# EAGLE design HHKBLite2BTforArduinoProMicro33 (EAGLE 7.1.0)
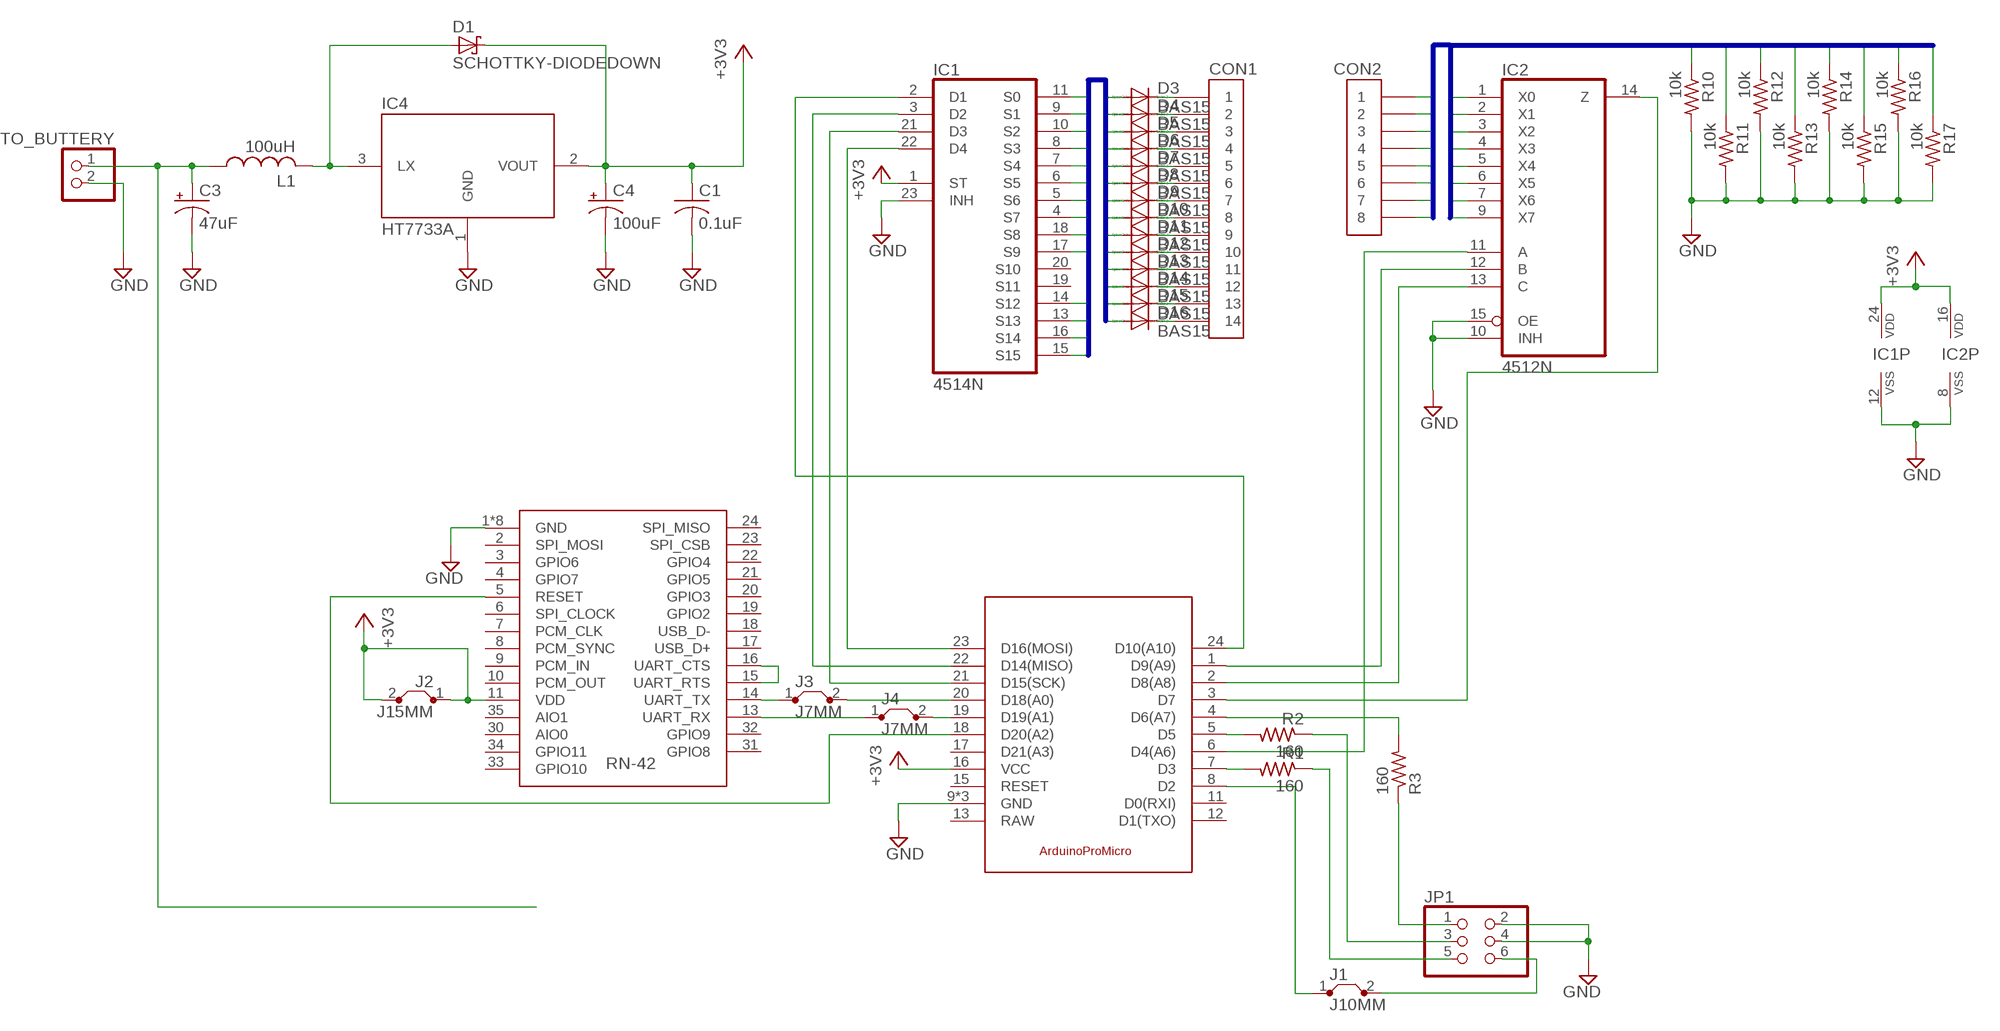
[diagram p0: schematic, sheet 1]

## Parts
C1  0.1uF  C-US050-024X044  [C050-024X044]
C3  47uF  CPOL-USE2.5-7  [E2,5-7]
C4  100uF  CPOL-USE2.5-7  [E2,5-7]
CON1  45045-1445  [52045-1445]
CON2  45045-0845  [52045-0845]
D1  SCHOTTKY-DIODEDOWN  [DIODE-STAND-DOWN]
D3  BAS15  [DO34-7]
D4  BAS15  [DO34-7]
D5  BAS15  [DO34-7]
D6  BAS15  [DO34-7]
D7  BAS15  [DO34-7]
D8  BAS15  [DO34-7]
D9  BAS15  [DO34-7]
D10  BAS15  [DO34-7]
D11  BAS15  [DO34-7]
D12  BAS15  [DO34-7]
D13  BAS15  [DO34-7]
D14  BAS15  [DO34-7]
D15  BAS15  [DO34-7]
D16  BAS15  [DO34-7]
IC1  4514N  [DIL24-6]
IC2  4512N  [DIL16]
IC4  HT7733A  [TO-92]
J1  J10MM  [10]
J2  J15MM  [15]
J3  J7MM  [07]
J4  J7MM  [07]
JP1  PINHD-2X3/90  [2X03/90]
L1  100uH  LL5-10  [E5-10]
R1  160  R-US_0207/7  [0207/7]
R2  160  R-US_0207/7  [0207/7]
R3  160  R-US_0207/10  [0207/10]
R10  10k  R-US_0207/7  [0207/7]
R11  10k  R-US_0207/7  [0207/7]
R12  10k  R-US_0207/7  [0207/7]
R13  10k  R-US_0207/10  [0207/10]
R14  10k  R-US_0207/7  [0207/7]
R15  10k  R-US_0207/7  [0207/7]
R16  10k  R-US_0207/7  [0207/7]
R17  10k  R-US_0207/7  [0207/7]
TO_BUTTERY  PINHD-1X2  [1X02]
U$1  RN-42  [RN-42]
U$2  ARDUINO_PRO_MICRO  [ARDUINO_PRO_MICRO]

## Nets
+3V3 [Vcc]: C1.1 C4.+ D1.C IC1.1(ST) IC1.24(VDD) IC2.16(VDD) IC4.2(VOUT) J2.1 J2.2 U$1.11(VDD) U$2.16(VCC)
CON1BUS_O0: D3.A IC1.11(S0)
CON1BUS_O1: D5.A IC1.9(S1)
CON1BUS_O2: D4.A IC1.10(S2)
CON1BUS_O3: D6.A IC1.8(S3)
CON1BUS_O4: D7.A IC1.7(S4)
CON1BUS_O5: D8.A IC1.6(S5)
CON1BUS_O6: D9.A IC1.5(S6)
CON1BUS_O7: D10.A IC1.4(S7)
CON1BUS_O8: D11.A IC1.18(S8)
CON1BUS_O9: D16.A IC1.17(S9)
CON1BUS_O12: D13.A IC1.14(S12)
CON1BUS_O13: D12.A IC1.13(S13)
CON1BUS_O14: D15.A IC1.16(S14)
CON1BUS_O15: D14.A IC1.15(S15)
CON2BUS_D0: CON2.8 IC2.1(X0) R10.1
CON2BUS_D1: CON2.7 IC2.2(X1) R11.1
CON2BUS_D2: CON2.6 IC2.3(X2) R12.1
CON2BUS_D3: CON2.5 IC2.4(X3) R13.1
CON2BUS_D4: CON2.4 IC2.5(X4) R14.1
CON2BUS_D5: CON2.3 IC2.6(X5) R15.1
CON2BUS_D6: CON2.2 IC2.7(X6) R16.1
CON2BUS_D7: CON2.1 IC2.9(X7) R17.1
GND [GND]: C1.2 C3.- C4.- IC1.12(VSS) IC1.23(INH) IC2.8(VSS) IC2.10(INH) IC2.15(OE) IC4.1(GND) JP1.2 JP1.4 R10.2 R11.2 R12.2 R13.2 R14.2 R15.2 R16.2 R17.2 TO_BUTTERY.2 U$1.1(GND) U$1.12(GND) U$1.28(GND) U$1.29(GND) U$1.GND1(GND) U$1.GND2(GND) U$1.GND3(GND) U$1.GND4(GND) U$2.9(GND) U$2.10(GND) U$2.14(GND)
N$1: R3.2 U$2.4(D6(A7))
N$2: R1.2 U$2.7(D3)
N$3 [VccSrc]: D1.A IC4.3(LX) L1.+1
N$4: R2.2 U$2.5(D5)
N$5: J3.1 U$1.14(UART_TX)
N$6: U$1.5(RESET) U$2.18(D20(A2))
N$7: J3.2 U$2.20(D18(A0))
N$8: JP1.1 R3.1
N$9: IC2.14(Z) U$2.3(D7)
N$10: JP1.3 R2.1
N$11: JP1.5 R1.1
N$12: J1.2 JP1.6
N$13: J1.1 U$2.8(D2)
N$14: J4.1 U$1.13(UART_RX)
N$16: IC2.12(B) U$2.1(D9(A9))
N$17: IC2.13(C) U$2.2(D8(A8))
N$18: J4.2 U$2.19(D19(A1))
N$20: U$1.15(UART_RTS) U$1.16(UART_CTS)
N$22: IC2.11(A) U$2.6(D4(A6))
N$36: IC1.2(D1) U$2.24(D10(A10))
N$37: IC1.3(D2) U$2.22(D14(MISO))
N$38: IC1.21(D3) U$2.21(D15(SCK))
N$39: IC1.22(D4) U$2.23(D16(MOSI))
N$49: CON1.1 D3.C
N$50: CON1.2 D4.C
N$51: CON1.3 D5.C
N$52: CON1.4 D6.C
N$53: CON1.5 D7.C
N$54: CON1.6 D8.C
N$55: CON1.7 D9.C
N$56: CON1.8 D10.C
N$57: CON1.9 D11.C
N$58: CON1.10 D12.C
N$59: CON1.11 D13.C
N$60: CON1.12 D14.C
N$61: CON1.13 D15.C
N$62: CON1.14 D16.C
VCC_SRC [VccSrc]: C3.+ L1.+ TO_BUTTERY.1
Unconnected: IC1.19(S11) IC1.20(S10) U$1.2(SPI_MOSI) U$1.3(GPIO6) U$1.4(GPIO7) U$1.6(SPI_CLOCK) U$1.7(PCM_CLK) U$1.8(PCM_SYNC) U$1.9(PCM_IN) U$1.10(PCM_OUT) U$1.17(USB_D+) U$1.18(USB_D-) U$1.19(GPIO2) U$1.20(GPIO3) U$1.21(GPIO5) U$1.22(GPIO4) U$1.23(SPI_CSB) U$1.24(SPI_MISO) U$1.30(AIO0) U$1.31(GPIO8) U$1.32(GPIO9) U$1.33(GPIO10) U$1.34(GPIO11) U$1.35(AIO1) U$2.11(D0(RXI)) U$2.12(D1(TXO)) U$2.13(RAW) U$2.15(RESET) U$2.17(D21(A3))

## Buses
CON2BUS_D[0..7]
CON1BUS_O[0..15]

## Library data of the parts
C1 = rcl:C-US: CAPACITOR, American symbol
C3 C4 = rcl:CPOL-US: POLARIZED CAPACITOR, American symbol
CON1 = 5204:45045-1445
CON2 = 5204:45045-0845
D1 = MySilicon:SCHOTTKY-DIODE
D3-D16 = diode:BAS15: DIODE high speed
IC1 = 45xx:4514: 4-bit latch 4-16 line DECODER
IC2 = 45xx:4512: 8-channel DATA SELECTOR Inhibit function corrected - 2005.10.04 librarian@cadsoft.de
IC4 = HT77XXA:HT7733A
J1-J4 = jumper:J: Bridge
JP1 = pinhead:PINHD-2X3: PIN HEADER
L1 = MyRCL:L
R1-R3 R10-R12 R14-R17 = rcl:R-US_: RESISTOR, American symbol
R13 = resistor:R-US_: RESISTOR, American symbol
TO_BUTTERY = pinhead:PINHD-1X2: PIN HEADER
U$1 = RN-42:RN-42
U$2 = ArduinoProMicro:ARDUINO_PRO_MICRO

## Net classes
0 default: clearance 0.254 mm
1 Vcc: width 0.025 mm, clearance 0.205 mm
2 VccSrc: clearance 0.508 mm
3 GND: clearance 0.508 mm to class 1, clearance 0.508 mm to class 2, clearance 0.205 mm

## Board
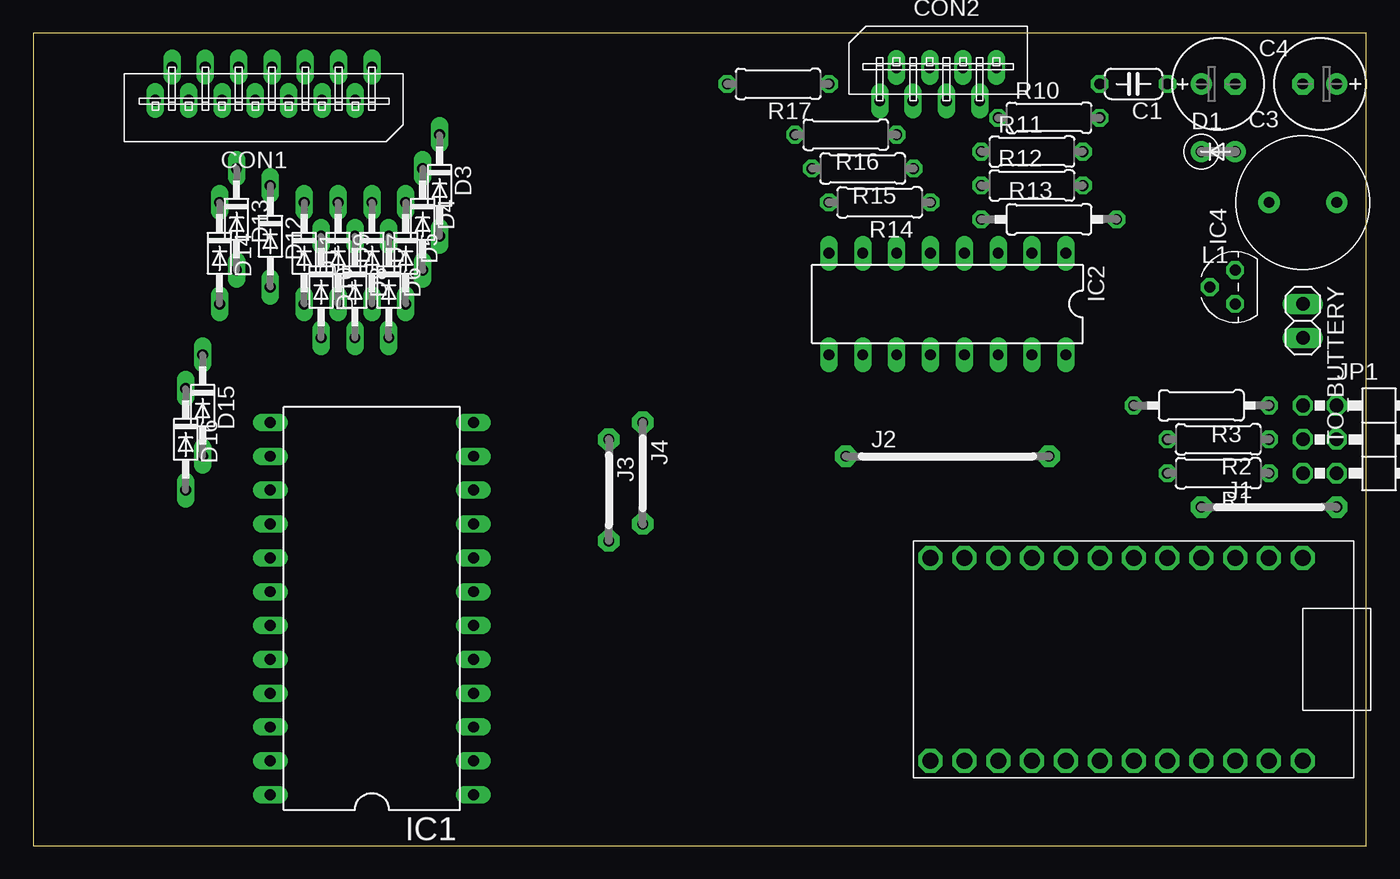
[diagram p1: board, top side]
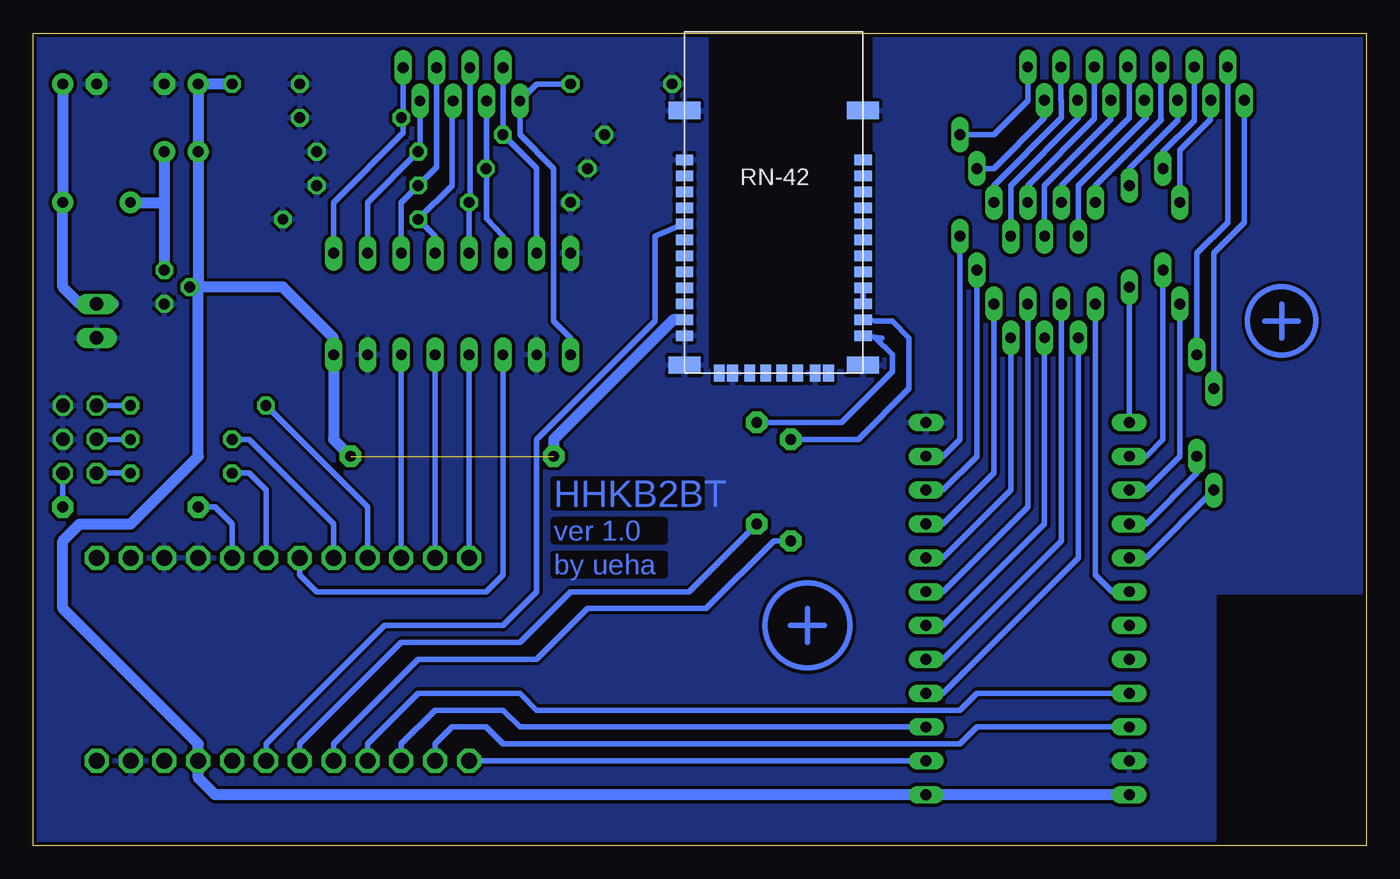
[diagram p2: board, bottom side, seen from below]

Size 100 x 60.95 mm. Coordinates in mm from the lower left corner, seen from the top.
Outline: 0,0 100,0 100,60.95 0,60.95 0,0
Copper layers (1*16): Top 0.035mm / dielectric 1.5mm / Bottom 0.035mm
Design rules "HHKBLite2BTforArduinoProMicro33 *": minimum track width 10mil, minimum drill 24mil, track to track 0.205mm, track to pad 0.205mm, pad to pad 0.205mm, via to via 0.205mm, smd to smd 8mil, copper to edge 0.2mm, drill to drill 8mil, minimum pad ring 10mil, minimum via ring 8mil, stop-mask expansion 4mil, vias tented up to drill 0mil, thermal gap 10mil

### Footprints (pad centres in the part's own frame; a part is rotated, then mirrored left to right if it is on the bottom)
C050-024X044 = drill 0.813 octagon: 1 -2.54,0; 2 2.54,0
E2,5-7 = drill 0.813 pad 1.6: + -1.27,0 | drill 0.813 pad 1.6 octagon: - 1.27,0
52045-1445 = drill 0.813 long: 1 0,0; 2 1.25,2.5; 3 2.5,0; 4 3.75,2.5; 5 5,0; 6 6.25,2.5; 7 7.5,0; 8 8.75,2.5; 9 10,0; 10 11.25,2.5; 11 12.5,0; 12 13.75,2.5; 13 15,0; 14 16.25,2.5
52045-0845 = drill 0.813 long: 1 0,0; 2 1.25,2.5; 3 2.5,0; 4 3.75,2.5; 5 5,0; 6 6.25,2.5; 7 7.5,0; 8 8.75,2.5
DIODE-STAND-DOWN = drill 0.813 pad 1.6: A 1.27,0; C -1.27,0
DO34-7 = drill 0.813 long: A 3.81,0; C -3.81,0
DIL24-6 = drill 0.813 long: 1 -13.97,-7.62; 2 -11.43,-7.62; 3 -8.89,-7.62; 4 -6.35,-7.62; 5 -3.81,-7.62; 6 -1.27,-7.62; 7 1.27,-7.62; 8 3.81,-7.62; 9 6.35,-7.62; 10 8.89,-7.62; 11 11.43,-7.62; 12 13.97,-7.62; 13 13.97,7.62; 14 11.43,7.62; 15 8.89,7.62; 16 6.35,7.62; 17 3.81,7.62; 18 1.27,7.62; 19 -1.27,7.62; 20 -3.81,7.62; 21 -6.35,7.62; 22 -8.89,7.62; 23 -11.43,7.62; 24 -13.97,7.62
DIL16 = drill 0.813 long: 1 -8.89,-3.81; 2 -6.35,-3.81; 3 -3.81,-3.81; 4 -1.27,-3.81; 5 1.27,-3.81; 6 3.81,-3.81; 7 6.35,-3.81; 8 8.89,-3.81; 9 8.89,3.81; 10 6.35,3.81; 11 3.81,3.81; 12 1.27,3.81; 13 -1.27,3.81; 14 -3.81,3.81; 15 -6.35,3.81; 16 -8.89,3.81
TO-92 = drill 0.813 octagon: 1 -1.27,0; 2 0,1.905; 3 1.27,0
10 = drill 0.813 pad 1.6 octagon: 1 -5.08,0; 2 5.08,0
15 = drill 0.813 pad 1.6 octagon: 1 -7.62,0; 2 7.62,0
07 = drill 0.813 pad 1.6 octagon: 1 -3.81,0; 2 3.81,0
2X03/90 = drill 1.016 octagon: 1 -2.54,-6.35; 2 -2.54,-3.81; 3 0,-6.35; 4 0,-3.81; 5 2.54,-6.35; 6 2.54,-3.81
E5-10 = drill 0.813 pad 1.6: + -2.54,0; +1 2.54,0
0207/7 = drill 0.813 octagon: 1 -3.81,0; 2 3.81,0
0207/10 = drill 0.813 octagon: 1 -5.08,0; 2 5.08,0
1X02 = drill 1.016 long: 1 -1.27,0; 2 1.27,0
RN-42 = smd 1.3 x 0.8: 1 -6.7,3.2; 2 -6.7,2; 3 -6.7,0.8; 4 -6.7,-0.4; 5 -6.7,-1.6; 6 -6.7,-2.8; 7 -6.7,-4; 8 -6.7,-5.2; 9 -6.7,-6.4; 10 -6.7,-7.6; 11 -6.7,-8.8; 12 -6.7,-10; 13 6.7,-10; 14 6.7,-8.8; 15 6.7,-7.6; 16 6.7,-6.4; 17 6.7,-5.2; 18 6.7,-4; 19 6.7,-2.8; 20 6.7,-1.6; 21 6.7,-0.4; 22 6.7,0.8; 23 6.7,2; 24 6.7,3.2 | smd 0.8 x 1.3: 28 3.1,-12.8; 29 -3.1,-12.8; 30 4.1,-12.8; 31 1.8,-12.8; 32 0.6,-12.8; 33 -0.6,-12.8; 34 -1.8,-12.8; 35 -4.1,-12.8 | smd 2.4 x 1.3: GND1 -6.7,6.9; GND2 6.7,6.9; GND3 -6.7,-12.2; GND4 6.7,-12.2
ARDUINO_PRO_MICRO = drill 1.2 octagon: 1 -7.62,-15.24; 2 -7.62,-12.7; 3 -7.62,-10.16; 4 -7.62,-7.62; 5 -7.62,-5.08; 6 -7.62,-2.54; 7 -7.62,0; 8 -7.62,2.54; 9 -7.62,5.08; 10 -7.62,7.62; 11 -7.62,10.16; 12 -7.62,12.7; 13 7.62,12.7; 14 7.62,10.16; 15 7.62,7.62; 16 7.62,5.08; 17 7.62,2.54; 18 7.62,0; 19 7.62,-2.54; 20 7.62,-5.08; 21 7.62,-7.62; 22 7.62,-10.16; 23 7.62,-12.7; 24 7.62,-15.24

### Placement (x,y rotation side)
C1  82.55,57.15 180 top
C3  96.52,57.15 180 top
C4  88.9,57.15 0 top
CON1  25.4,58.42 180 top
CON2  63.5,55.88 0 top
D1  88.9,52.07 0 top
D3  30.48,49.53 270 top
D4  29.21,46.99 270 top
D5  27.94,44.45 270 top
D6  26.67,41.91 270 top
D7  25.4,44.45 270 top
D8  24.13,41.91 270 top
D9  22.86,44.45 270 top
D10  21.59,41.91 270 top
D11  20.32,44.45 270 top
D12  17.78,45.72 270 top
D13  15.24,46.99 270 top
D14  13.97,44.45 270 top
D15  12.7,33.02 270 top
D16  11.43,30.48 270 top
IC1  25.4,17.78 90 top
IC2  68.58,40.64 180 top
IC4  90.17,41.91 90 top
J1  92.71,25.4 0 top
J2  68.58,29.21 0 top
J3  43.18,26.67 270 top
J4  45.72,27.94 270 top
JP1  101.6,30.48 270 top
L1  95.25,48.26 180 top
R1  88.9,27.94 180 top
R2  88.9,30.48 180 top
R3  87.63,33.02 180 top
R10  76.2,54.61 0 top
R11  74.93,52.07 0 top
R12  74.93,49.53 0 top
R13  76.2,46.99 0 top
R14  63.5,48.26 180 top
R15  62.23,50.8 180 top
R16  60.96,53.34 180 top
R17  55.88,57.15 180 top
TO_BUTTERY  95.25,39.37 270 top
U$1  44.45,48.26 0 bottom
U$2  82.55,13.97 270 top

### Tracks (layer width: path | path; a pad name or v marks a point on that pad's centre or on a via)
+3V3  (1 unrouted)
  Bottom 0.813: IC1.24 IC1.1 86.36,3.81 87.63,5.08 U$2.16 87.63,7.62 97.79,17.78 97.79,22.86 96.52,24.13 92.71,24.13 87.63,29.21 87.63,41.91 | U$1.11 51.98,39.46 60.96,30.48 J2.1 | 87.63,41.91 IC4.2 | 87.63,41.91 81.28,41.91 77.47,38.1 IC2.16 77.47,30.48 J2.2 | C1.1 C4.+ D1.C 87.63,41.91
CON1BUS_O0
  Bottom 0.406: D3.A 30.48,30.48 31.75,29.21 IC1.11
CON1BUS_O1
  Bottom 0.406: D5.A 27.94,27.94 31.75,24.13 IC1.9
CON1BUS_O2
  Bottom 0.406: D4.A 29.21,29.21 31.75,26.67 IC1.10
CON1BUS_O3
  Bottom 0.406: D6.A 26.67,26.67 31.75,21.59 IC1.8
CON1BUS_O4
  Bottom 0.406: D7.A 25.4,25.4 31.75,19.05 IC1.7
CON1BUS_O5
  Bottom 0.406: D8.A 24.13,24.13 31.75,16.51 IC1.6
CON1BUS_O6
  Bottom 0.406: D9.A 22.86,22.86 31.75,13.97 IC1.5
CON1BUS_O7
  Bottom 0.406: D10.A 21.59,21.59 31.75,11.43 IC1.4
CON1BUS_O8
  Bottom 0.406: D11.A 20.32,20.32 19.05,19.05 IC1.18
CON1BUS_O9
  Bottom 0.406: IC1.17 16.51,21.59 D16.A
CON1BUS_O12
  Bottom 0.406: D13.A 15.24,30.48 16.51,29.21 IC1.14
CON1BUS_O13
  Bottom 0.406: D12.A IC1.13
CON1BUS_O14
  Bottom 0.406: IC1.16 16.51,24.13 12.7,27.94 D15.A
CON1BUS_O15
  Bottom 0.406: D14.A 13.97,29.21 16.51,26.67 IC1.15
CON2BUS_D0
  Bottom 0.406: CON2.8 72.25,54.61 | 72.25,54.61 72.25,53.48 77.47,48.26 IC2.1 | R10.1 72.25,54.61
CON2BUS_D1
  Bottom 0.406: CON2.7 71,52.19 R11.1 74.93,48.26 IC2.2
CON2BUS_D2
  Bottom 0.406: CON2.6 69.75,50.9 R12.1 72.39,48.26 IC2.3
CON2BUS_D3
  Bottom 0.406: IC2.4 69.85,45.72 R13.1 68.58,49.53 68.58,55.8 CON2.5
CON2BUS_D4
  Bottom 0.406: CON2.4 67.25,48.32 R14.1 IC2.5
CON2BUS_D5
  Bottom 0.406: CON2.3 66,50.8 | 66,50.8 66,47.03 64.77,45.72 IC2.6 | R15.1 66,50.8
CON2BUS_D6
  Bottom 0.406: CON2.2 64.75,53.34 | 62.21,45.74 IC2.7 62.23,50.82 64.75,53.34 | R16.1 64.75,53.34
CON2BUS_D7
  Bottom 0.406: R17.1 62.23,57.15 CON2.1 63.5,53.34 60.96,50.8 60.96,39.37 59.69,38.1 IC2.9
GND
  pour Bottom (isolate 0.254): 0,19.05 11.43,19.05 11.43,0 100.33,0 100.33,60.96 49.53,60.96 49.53,35.56 36.83,35.56 36.83,60.96 0,60.96
N$1
  Bottom 0.406: 74.93,22.86 U$2.4 74.93,25.4 R3.2
N$2
  Bottom 0.406: U$2.7 82.55,26.67 83.82,27.94 R1.2
N$3
  Bottom 0.813: D1.A 90.17,48.26 | 90.17,48.26 IC4.3 | L1.+1 90.17,48.26
N$4
  Bottom 0.406: U$2.5 77.47,24.13 83.82,30.48 R2.2
N$5
  Bottom 0.406: U$1.14 36.57,39.37 | 36.57,39.37 36.83,39.37 | 36.57,39.37 35.56,39.37 34.29,38.1 34.29,34.29 38.1,30.48 J3.1
N$6
  Bottom 0.406: U$1.5 51.13,46.66 53.34,45.72 53.34,39.37 62.23,30.48 62.23,19.05 64.77,16.51 73.66,16.51 82.55,7.62 U$2.18
N$7
  Bottom 0.406: U$2.20 77.47,7.62 71.12,13.97 62.23,13.97 58.42,17.78 49.53,17.78 44.45,22.86 J3.2
N$8
  Bottom 0.406: R3.1 JP1.1
N$9
  Bottom 0.406: IC2.14 U$2.3
N$10
  Bottom 0.406: R2.1 JP1.3
N$11
  Bottom 0.406: R1.1 JP1.5
N$12
  Bottom 0.406: J1.2 JP1.6
N$13
  Bottom 0.406: J1.1 86.36,25.4 85.09,24.13 U$2.8
N$14
  Bottom 0.406: U$1.13 36.32,38.1 36.83,38.1 35.56,36.83 35.56,35.56 39.37,31.75 J4.1
N$15
  Bottom 0.406: 5.08,39.37 6.35,39.37 | 7.62,39.37 6.35,39.37 | 6.35,39.37 6.35,40.64 | 6.35,39.37 6.35,38.1
N$16
  Bottom 0.406: IC2.12 U$2.1
N$17
  Bottom 0.406: IC2.13 U$2.2
N$18
  Bottom 0.406: U$2.19 80.01,7.62 72.39,15.24 63.5,15.24 59.69,19.05 50.8,19.05 J4.2
N$20
  Bottom 0.406: U$1.16 U$1.15
N$22
  Bottom 0.406: IC2.11 64.77,20.32 66.04,19.05 78.74,19.05 80.01,20.32 U$2.6
N$23
  Bottom 0.406: 40.64,16.51 43.18,16.51
N$24
  Bottom 0.406: 41.91,17.78 41.91,15.24
N$36
  Bottom 0.406: IC1.2 U$2.24
N$37
  Bottom 0.406: U$2.22 72.39,7.62 69.85,10.16 64.77,10.16 63.5,8.89 IC1.3
N$38
  Bottom 0.406: IC1.21 29.21,11.43 30.48,10.16 62.23,10.16 63.5,11.43 71.12,11.43 74.93,7.62 U$2.21
N$39
  Bottom 0.406: IC1.22 29.21,8.89 30.48,7.62 64.77,7.62 66.04,8.89 68.58,8.89 69.85,7.62 U$2.23
N$49
  Bottom 0.406: CON1.1 25.4,55.88 27.94,53.34 D3.C
N$50
  Bottom 0.406: CON1.2 24.19,55.88 24.19,54.67 24.13,54.61 27.94,50.8 D4.C
N$51
  Bottom 0.406: CON1.3 22.9,55.92 22.86,55.88 22.86,54.61 27.94,49.53 D5.C
N$52
  Bottom 0.406: CON1.4 21.65,54.67 21.59,54.61 26.67,49.53 D6.C
N$53
  Bottom 0.406: CON1.5 20.4,54.53 25.4,49.53 D7.C
N$54
  Bottom 0.406: D8.C 24.13,49.53 19.15,54.51 CON1.6
N$55
  Bottom 0.406: D9.C 22.86,49.53 17.78,54.61 17.78,58.3 CON1.7
N$56
  Bottom 0.406: D10.C 21.59,49.53 16.51,54.61 16.51,55.78 CON1.8
N$57
  Bottom 0.406: D11.C 20.32,49.53 15.37,54.48 15.4,54.52 CON1.9
N$58
  Bottom 0.406: D12.C 17.78,50.8 14.15,54.43 CON1.10
N$59
  Bottom 0.406: D13.C 15.24,52.07 12.9,54.41 CON1.11
N$60
  Bottom 0.406: D14.C 13.97,52.2 11.68,54.48 11.68,55.89 CON1.12
N$61
  Bottom 0.406: CON1.13 10.4,46.75 12.7,44.45 D15.C
N$62
  Bottom 0.406: CON1.14 9.15,46.73 11.43,44.45 D16.C
VCC_SRC
  Bottom 0.813: C3.+ L1.+ 97.79,41.91 96.52,40.64 TO_BUTTERY.1 93.98,40.64
(copper drawn outside any net)
  shapes: Bottom circle x2

### Text on the board
Bottom: HHKB2BT | ver 1.0 | by ueha